# EAGLE design controlMotores (EAGLE 9.3.0)
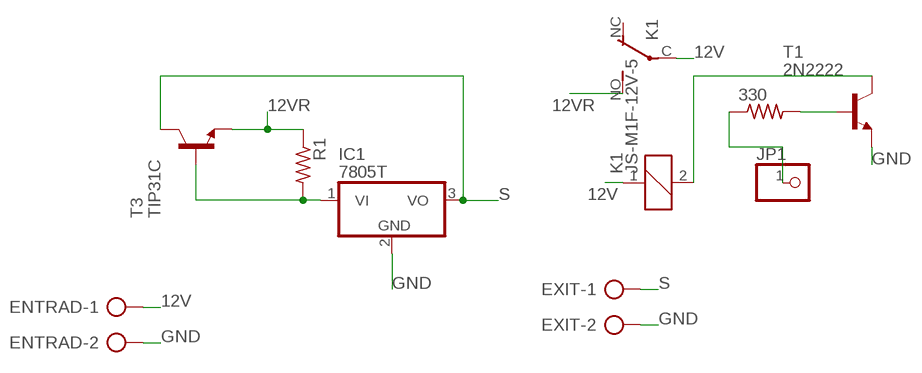
[diagram p0: schematic, sheet 1]

## Parts
330  R-US_0204/7  [0204/7]
ENTRAD  AK500/2-H  [AK500/2-H]
EXIT  AK500/2-H  [AK500/2-H]
IC1  7805T  [TO220H]
JP1  PINHD-1X1  [1X01]
K1  JS-M1F-12V-5  [JS-M]
R1  R-US_0207/12  [0207/12]
T1  2N2222  [TO18]
T3  TIP31C  [TO220]

## Nets
12V: ENTRAD.1 K1.1 K1.C(2:P)
12VR: K1.NO(2:S) R1.1 T3.3(E)
GND: ENTRAD.2 EXIT.2 IC1.2(GND) T1.1(E)
N$1: 330.1 JP1.1
N$2: 330.2 T1.2(B)
N$3: K1.2 T1.3(C)
N$4: IC1.1(VI) R1.2 T3.1(B)
S: EXIT.1 IC1.3(VO) T3.2(C)
Unconnected: K1.NC(2:O)

## Library data of the parts
330 R1 = rcl:R-US_: RESISTOR, American symbol; SPICEPREFIX: R
ENTRAD EXIT = con-ptr500:AK500/2-H: CONNECTOR Aug. 2004 / PTR Meßtechnik: Die Bezeichnung der Serie AK505 wurde geändert. Es handelt sich hierbei um AK500 in horizontaler Ausführung.; OC_FARNELL: unknown; OC_NEWARK: unknown
IC1 = linear:78*: Positive VOLTAGE REGULATOR Source: http://cache.national.com/ds/LM/LM78L05.pdf http://www.fairchildsemi.com/ds/LM/LM7805.pdf
JP1 = pinhead:PINHD-1X1: PIN HEADER
K1 = relay:JS-M1*: Automotive Ultra-Miniature Power Relay NAiS Source: http://www.mew-europe.com/.. en_ds_61211_0000.pdf; OC_FARNELL: unknown; OC_NEWARK: unknown
T1 = transistor-neu-to92:2N2222: NPN TRANSISTOR
T3 = transistor:TIP31: NPN Transistor Medium Power Linear Switching Applications Source: http://onsemi.com

## Board
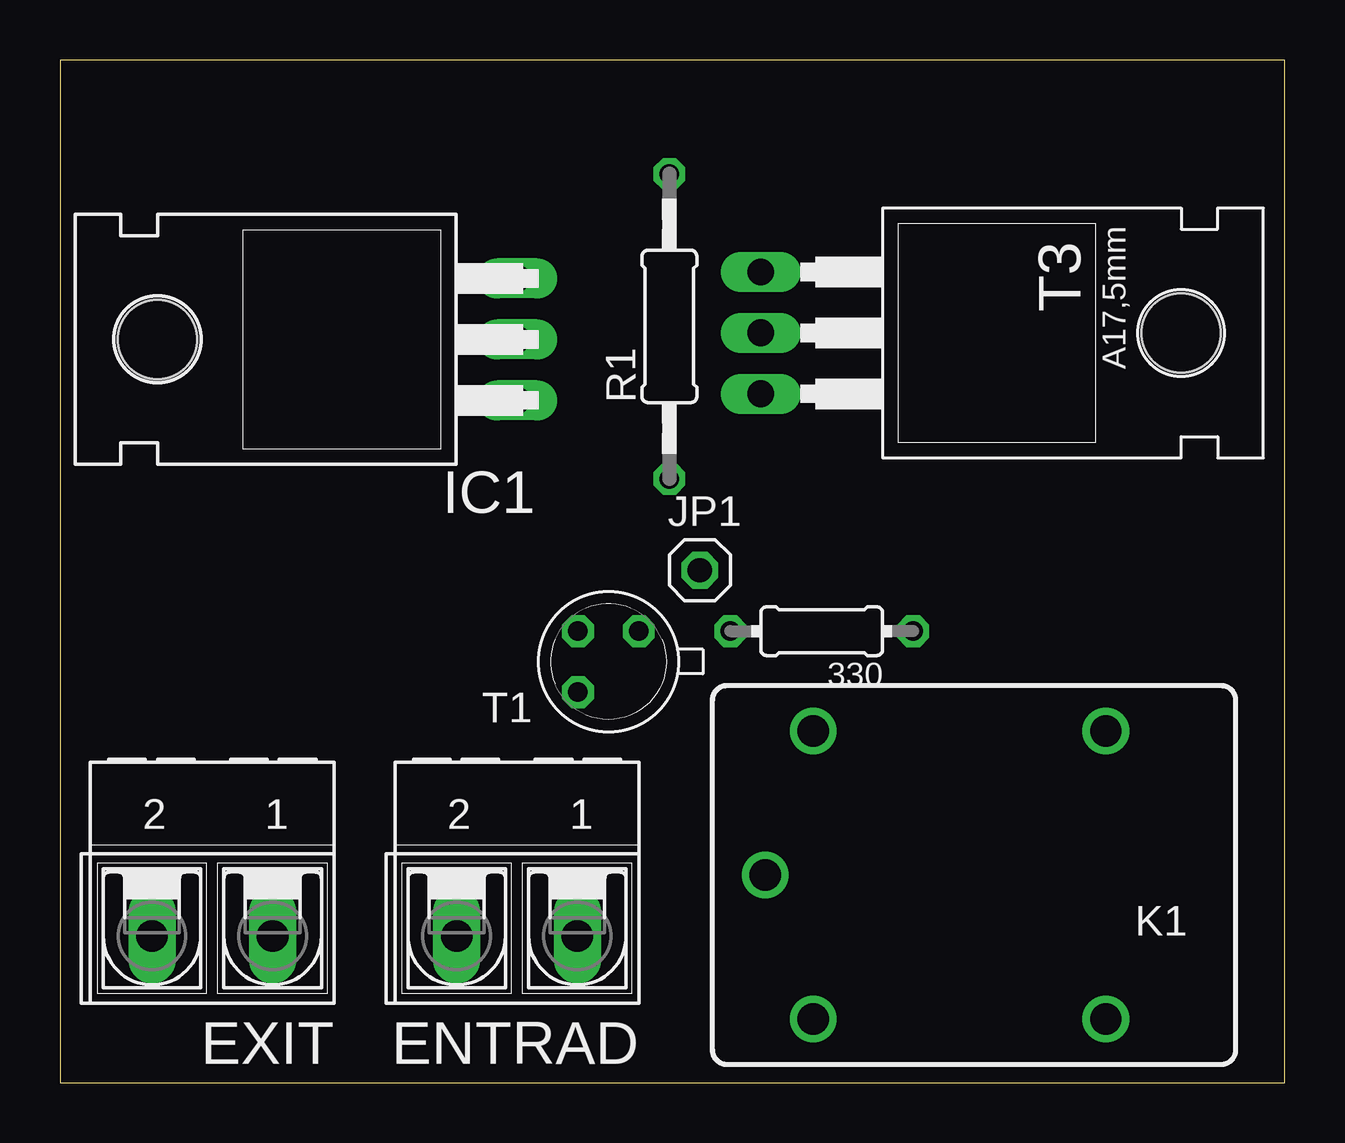
[diagram p1: board, top side]
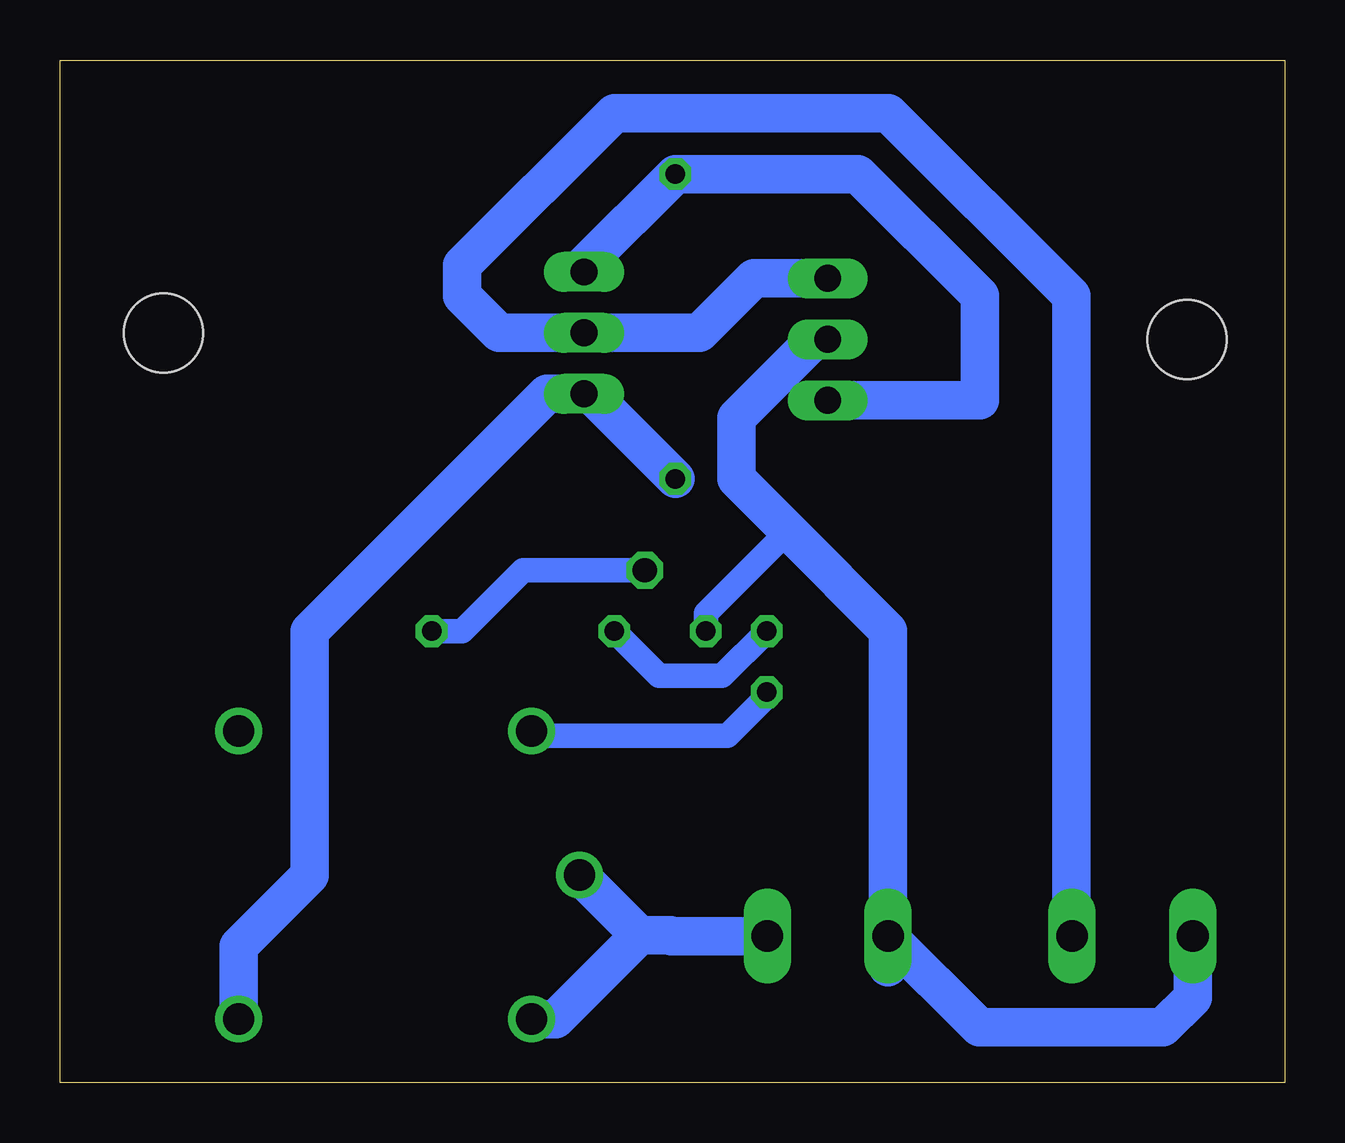
[diagram p2: board, bottom side, seen from below]

Size 51.05 x 42.62 mm. Coordinates in mm from the lower left corner, seen from the top.
Outline: 0,0 51.05,0 51.05,42.62 0,42.62 0,0
Copper layers (1*16): Top 0.035mm / dielectric 1.5mm / Bottom 0.035mm
Design rules "default": minimum track width 6mil, minimum drill 0.35mm, track to track 6mil, track to pad 6mil, pad to pad 6mil, via to via 6mil, smd to smd 6mil, copper to edge 40mil, drill to drill 6mil, minimum pad ring 10mil, minimum via ring 8mil, stop-mask expansion 4mil, vias tented up to drill 0mil, thermal gap 10mil

### Footprints (pad centres in the part's own frame; a part is rotated, then mirrored left to right if it is on the bottom)
0204/7 = drill 0.813 octagon: 1 -3.81,0; 2 3.81,0
AK500/2-H = drill 1.321 long: 1 -2.515,0; 2 2.515,0
TO220H = drill 1.118 long: 1 -2.54,-10.16; 2 0,-10.16; 3 2.54,-10.16 | hole 3.302: 0,4.826
1X01 = drill 1.016 octagon: 1 0,0
JS-M = drill 1.3: 1 6.7,6; 2 6.7,-6; C 8.7,0; NC -5.5,-6; NO -5.5,6
0207/12 = drill 0.813 octagon: 1 -6.35,0; 2 6.35,0
TO18 = drill 0.813 octagon: 1 -1.27,-1.27; 2 1.27,-1.27; 3 1.27,1.27
TO220 = drill 1.118 long: 1 -2.54,-6.35; 2 0,-6.35; 3 2.54,-6.35 | hole 3.302: 0,11.176

### Placement (x,y rotation side)
330  31.75,18.82 180 top
ENTRAD  19.05,6.12 180 top
EXIT  6.35,6.12 180 top
IC1  8.89,30.98 90 top
JP1  26.67,21.36 0 top
K1  38.1,8.66 180 top
R1  25.4,31.52 90 top
T1  22.86,17.55 180 top
T3  35.56,31.25 270 top

### Tracks (layer width: path | path; a pad name or v marks a point on that pad's centre or on a via)
12V
  Bottom 1.6: K1.C 26.9,6.16 | 26.9,6.16 25.61,6.16 25.57,6.12 ENTRAD.1 | K1.1 30.4,2.66 26.9,6.16
12VR
  Bottom 1.6: K1.NO 43.6,5.7 40.64,8.66 40.64,18.82 30.75,28.71 T3.3 28.94,28.71 R1.1
GND
  Bottom 1.016: T1.1 24.13,19.56 20.69,23
  Bottom 1.6: EXIT.2 3.84,3.55 5.08,2.31 12.72,2.31 ENTRAD.2 | ENTRAD.2 16.54,4.83 | ENTRAD.2 16.54,18.85 20.69,23 22.86,25.17 22.86,27.71 19.59,30.98 IC1.2
N$1
  Bottom 1.016: 330.1 34.29,18.82 31.75,21.36 JP1.1
N$2
  Bottom 1.016: 330.2 26.08,16.96 23.45,16.96 T1.2
N$3
  Bottom 1.016: T1.3 21.59,16.1 23.23,14.46 31.2,14.46 K1.2
N$4
  Bottom 1.6: IC1.1 12.7,28.44 12.7,32.79 17.78,37.87 R1.2 29.21,34.06 T3.1
S
  Bottom 1.6: IC1.3 22.13,33.52 24.4,31.25 T3.2 32.75,31.25 34.29,32.79 34.29,34.06 27.94,40.41 16.51,40.41 8.89,32.79 8.89,6.15 EXIT.1